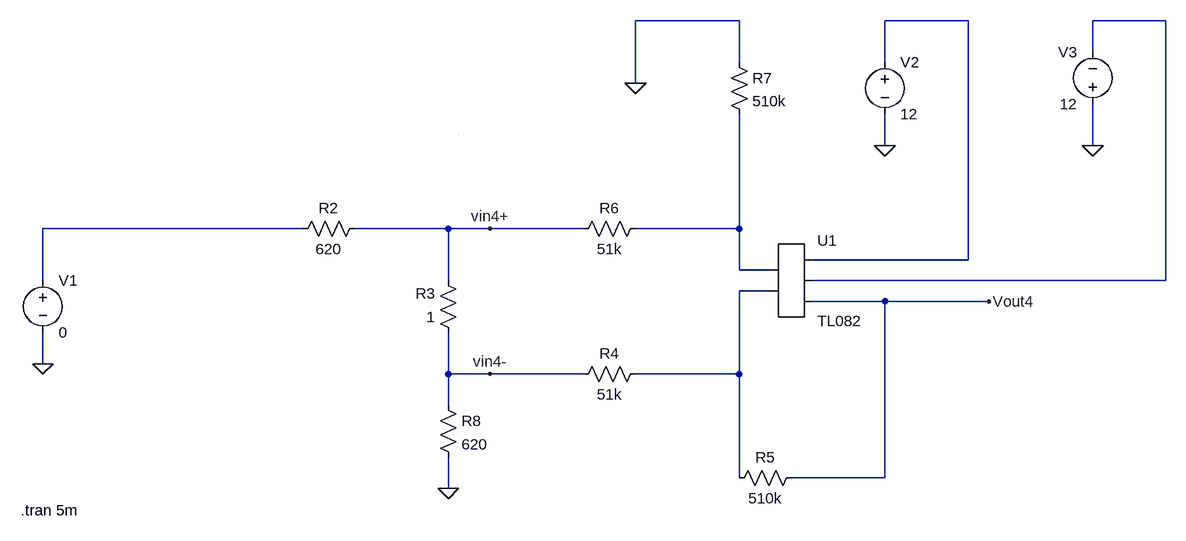
[diagram p0: schematic SimulacaoRelatorio1Part4TL.asc]
SimulacaoRelatorio1Part4TL.asc, the LTspice schematic file:
Version 4
SHEET 1 1092 680
WIRE 432 -176 272 -176
WIRE 784 -176 656 -176
WIRE 1088 -176 976 -176
WIRE 976 -128 976 -176
WIRE 432 -112 432 -176
WIRE 656 -112 656 -176
WIRE 272 -80 272 -176
WIRE 656 16 656 -32
WIRE 976 16 976 -48
WIRE -240 144 -640 144
WIRE -16 144 -160 144
WIRE 48 144 -16 144
WIRE 192 144 48 144
WIRE 432 144 432 -32
WIRE 432 144 272 144
WIRE 784 192 784 -176
WIRE 784 192 544 192
WIRE 432 208 432 144
WIRE 480 208 432 208
WIRE -640 224 -640 144
WIRE -16 224 -16 144
WIRE 1088 224 1088 -176
WIRE 1088 224 544 224
WIRE 480 240 432 240
WIRE 656 256 544 256
WIRE 816 256 656 256
WIRE -640 352 -640 304
WIRE -16 368 -16 304
WIRE 48 368 -16 368
WIRE 192 368 48 368
WIRE 432 368 432 240
WIRE 432 368 272 368
WIRE -16 416 -16 368
WIRE 432 528 432 368
WIRE 656 528 656 256
WIRE 656 528 512 528
WIRE -16 544 -16 496
WIRE 0 0 0 0
FLAG -640 352 0
FLAG 272 -80 0
FLAG 656 16 0
FLAG 976 16 0
FLAG 816 256 Vout4
FLAG 48 144 vin4+
FLAG 48 368 vin4-
FLAG -16 544 0
SYMBOL voltage -640 208 R0
SYMATTR InstName V1
SYMATTR Value 0
SYMBOL res -144 128 R90
WINDOW 0 0 56 VBottom 2
WINDOW 3 32 56 VTop 2
SYMATTR InstName R2
SYMATTR Value 620
SYMBOL res 0 320 R180
WINDOW 0 36 76 Left 2
WINDOW 3 36 40 Left 2
SYMATTR InstName R3
SYMATTR Value 1
SYMBOL res 176 384 R270
WINDOW 0 32 56 VTop 2
WINDOW 3 0 56 VBottom 2
SYMATTR InstName R4
SYMATTR Value 51k
SYMBOL res 528 512 R90
WINDOW 0 0 56 VBottom 2
WINDOW 3 32 56 VTop 2
SYMATTR InstName R5
SYMATTR Value 510k
SYMBOL res 288 128 R90
WINDOW 0 0 56 VBottom 2
WINDOW 3 32 56 VTop 2
SYMATTR InstName R6
SYMATTR Value 51k
SYMBOL res 416 -128 R0
SYMATTR InstName R7
SYMATTR Value 510k
SYMBOL voltage 656 -128 R0
SYMATTR InstName V2
SYMATTR Value 12
SYMBOL voltage 976 -32 R180
WINDOW 0 24 96 Left 2
WINDOW 3 24 16 Left 2
WINDOW 123 0 0 Left 0
WINDOW 39 0 0 Left 0
SYMATTR InstName V3
SYMATTR Value 12
SYMBOL AutoGenerated\\TL082 512 224 R0
SYMATTR InstName U1
SYMBOL res -32 400 R0
SYMATTR InstName R8
SYMATTR Value 620
TEXT -674 578 Left 2 !.tran 5m

The netlist it stands for:
* SimulacaoRelatorio1Part4TL.asc
V1 N003 0 0
R2 vin4+ N003 620
R3 vin4- vin4+ 1
R4 vin4- N005 51k
R5 Vout4 N005 510k
R6 N004 vin4+ 51k
R7 0 N004 510k
V2 N001 0 12
V3 0 N002 12
* U1: TL082 (symbol AutoGenerated\TL082 not available, pins judged from their places): pin1=N004 pin2=N005 pin3=N001 pin4=N002 pin5=Vout4
R8 vin4- 0 620
.tran 5m
.backanno
.end